# Altium schematic sheet WL-AUDIO.SchDoc
size 594 x 420 mm; Address1: Address1; Address2: Address2; Address3: Address3; Address4: Address4; DocumentNumber: Wolf-Lite; SheetNumber: 6; Scale: 1:1; DocumentType: Схема электрическая принципиальная; FirstReferrence: UA3REO/R7KBI
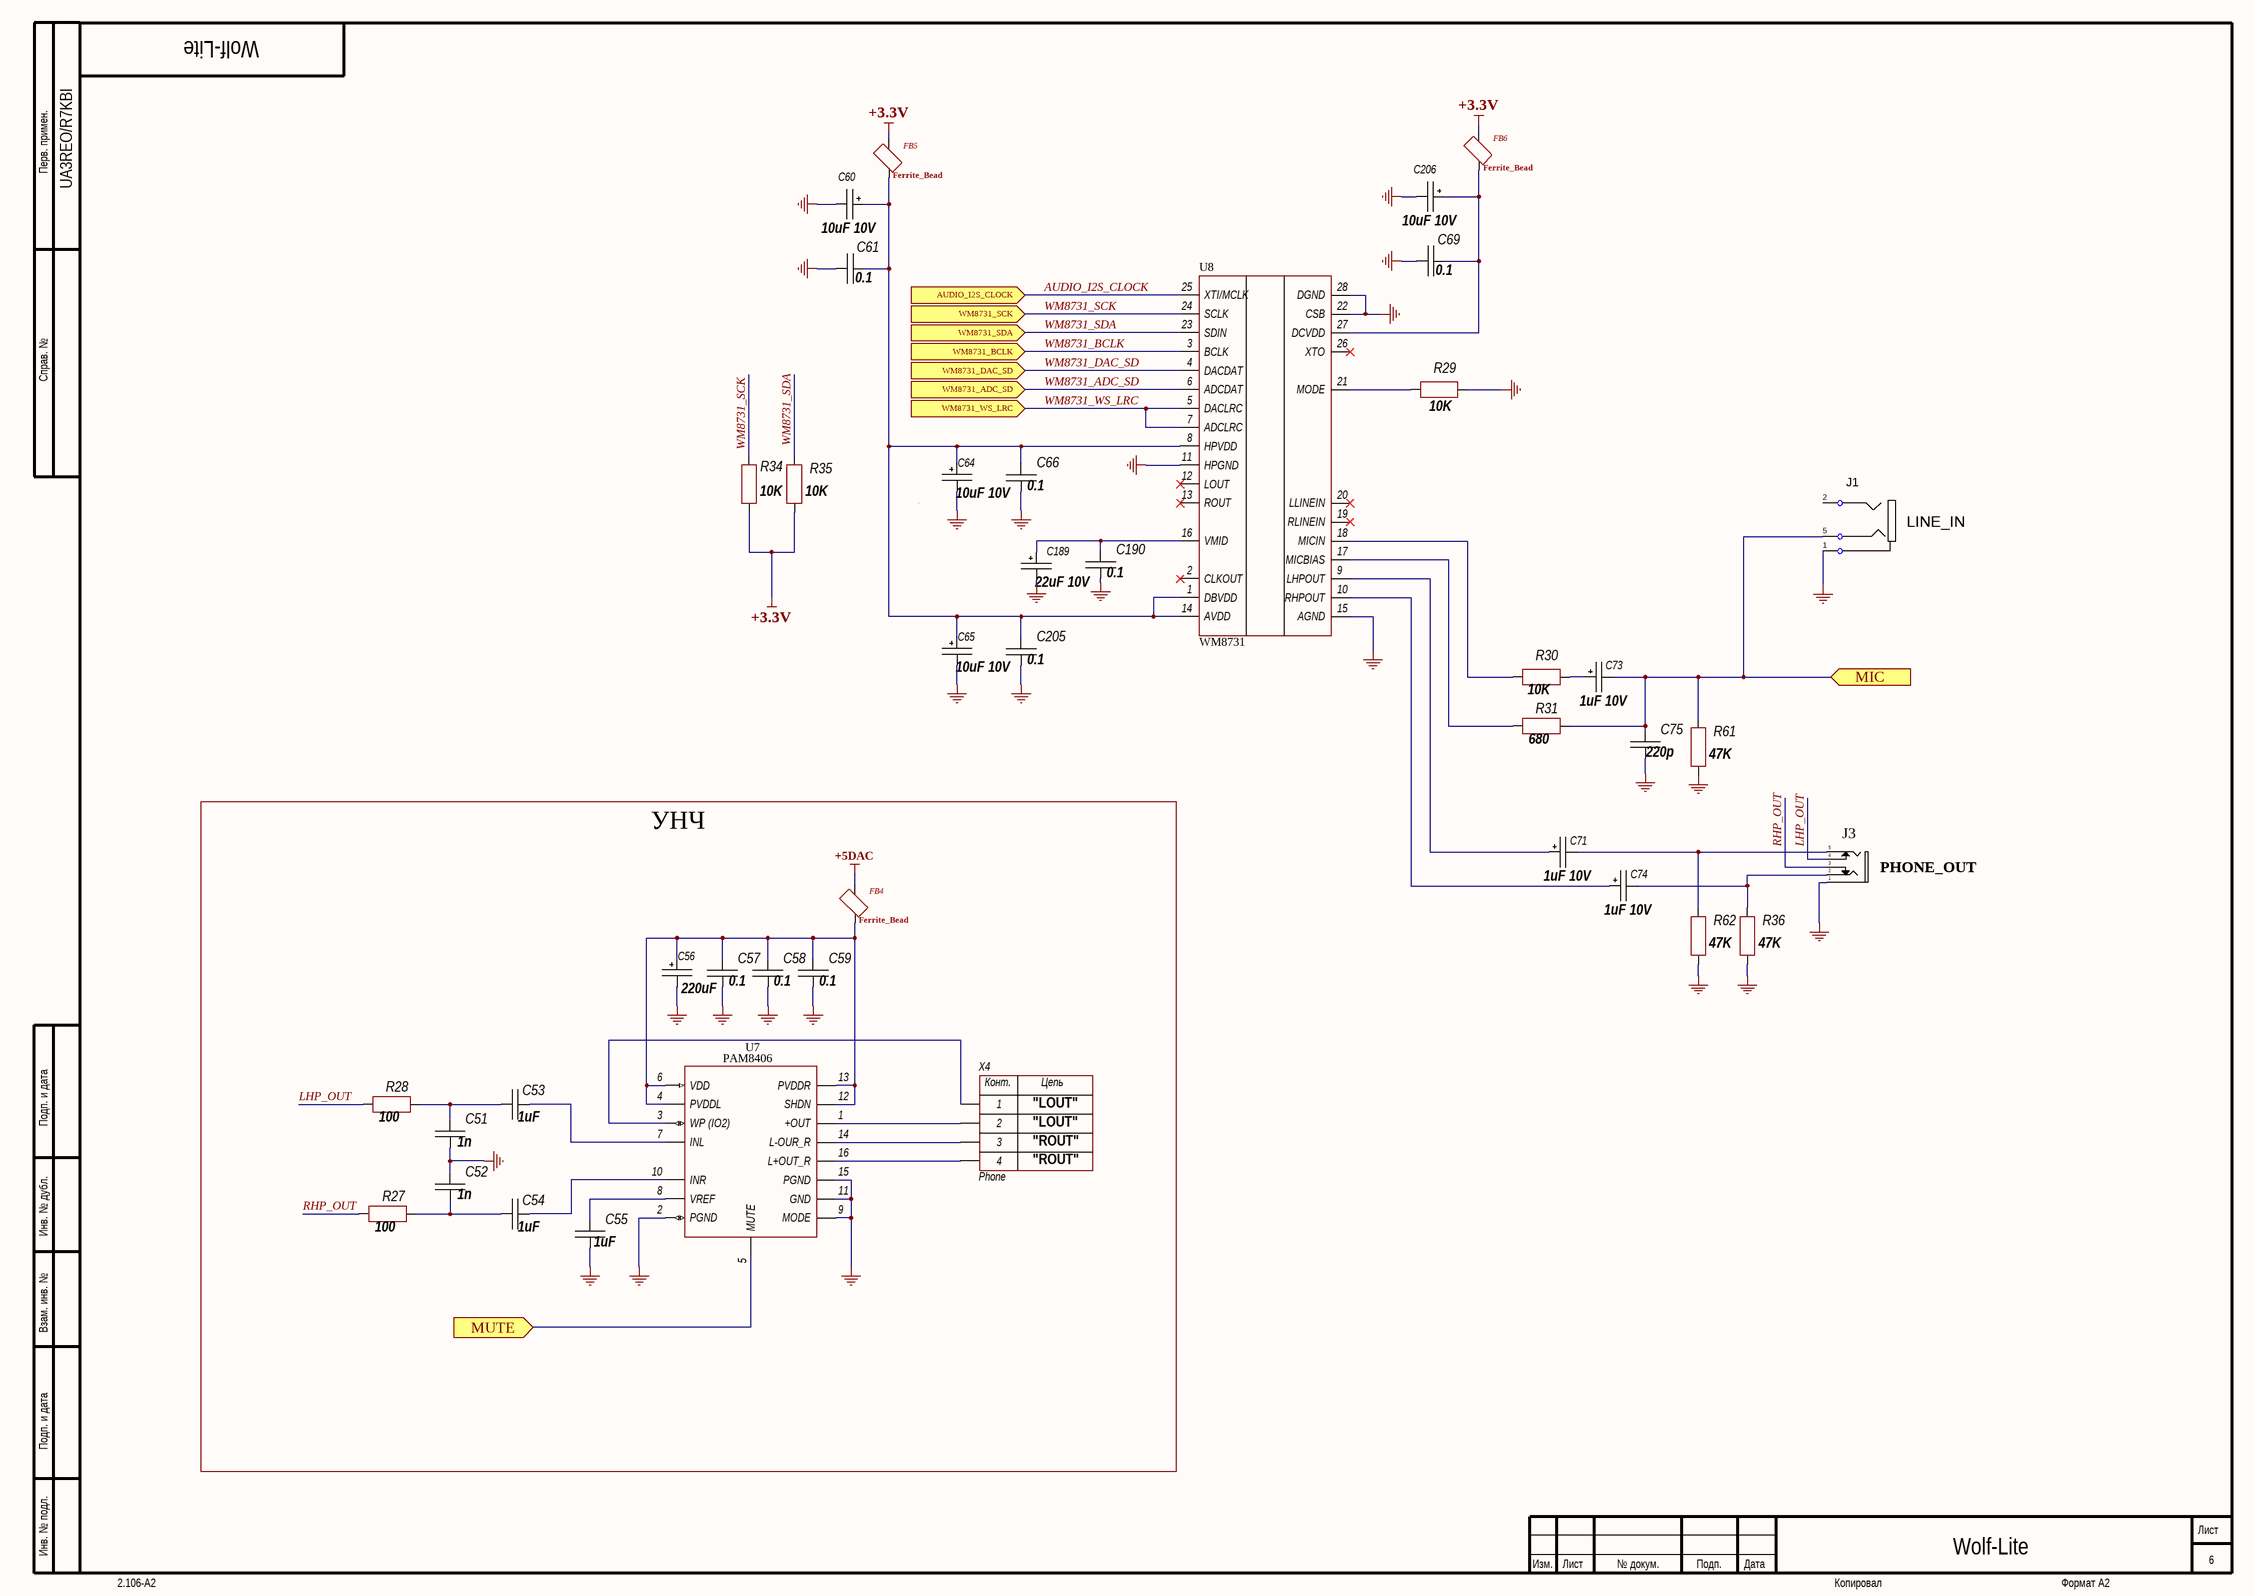
[diagram p0: WL-AUDIO.SchDoc]

## Parts
C51  1n  [CH0805C]
C52  1n  [CH0805C]
C53  1uF  [CH0805C]
C54  1uF  [CH0805C]
C55  1uF  [CH0805C]
C56  220uF  [POLIMER-E]
C57  0.1  [CH0805C]
C58  0.1  [CH0805C]
C59  0.1  [CH0805C]
C60  10uF 10V  [TANTAL_B]
C61  0.1  [CH0805C]
C64  10uF 10V  [TANTAL_B]
C65  10uF 10V  [TANTAL_B]
C66  0.1  [CH0805C]
C69  0.1  [CH0805C]
C71  1uF 10V  [TANTAL_A]
C73  1uF 10V  [TANTAL_A]
C74  1uF 10V  [TANTAL_A]
C75  220p  [CH0805C]
C189  22uF 10V  [TANTAL_B]
C190  0.1  [CH0805C]
C205  0.1  [CH0805C]
C206  10uF 10V  [TANTAL_B]
FB4  Ferrite_Bead  [CH0805L]
FB5  Ferrite_Bead  [CH0805L]
FB6  Ferrite_Bead  [CH0805L]
J1  value LINE_IN  [3.5-stereo]  (hidden comment: SJ1-3525NG)
J3  PHONE_OUT  [3.5-stereo]
R27  100  [CH0805R]
R28  100  [CH0805R]
R29  10K  [CH0805R]
R30  10K  [CH0805R]
R31  680  [CH0805R]
R34  10K  [CH0805R]
R35  10K  [CH0805R]
R36  47K  [CH0805R]
R61  47K  [CH0805R]
R62  47K  [CH0805R]
U7  PAM8406  [SOP-16]
U8  WM8731  [28-SSOP]
X4  Phone  [CON: CWF-4]

## Blocks framed on the sheet
УНЧ: C51-C59 FB4 R27 R28 U7 X4

## Ports
AUDIO_I2S_CLOCK (in), MIC (in), MUTE (in), WM8731_ADC_SD (in), WM8731_BCLK (in), WM8731_DAC_SD (in), WM8731_SCK (in), WM8731_SDA (in), WM8731_WS_LRC (in)

## Nets
+3.3V: FB5.2 FB6.2 R34.1 R35.1
+5DAC: FB4.2
GND: C51.2 C52.1 C55.2 C56.2 C57.2 C58.2 C59.2 C60.2 C61.2 C64.2 C65.2 C66.2 C69.2 C75.2 C189.2 C190.2 C205.2 C206.2 J1.1(sleeve) J3.1 R29.2 R36.1 R61.1 R62.1 U7.2(PGND) U7.9(MODE) U7.11(GND) U7.15(PGND) U8.11(HPGND) U8.15(AGND) U8.22(CSB) U8.28(DGND)
AUDIO_I2S_CLOCK: U8.25(XTI/MCLK) ; port AUDIO_I2S_CLOCK
LHP_OUT: J3.4 R28.1
MIC: C73.2 C75.1 J1.5(ring) R31.2 R61.2 ; port MIC
MUTE: U7.5(MUTE) ; port MUTE
RHP_OUT: J3.3 R27.1
WM8731_ADC_SD: U8.6(ADCDAT) ; port WM8731_ADC_SD
WM8731_BCLK: U8.3(BCLK) ; port WM8731_BCLK
WM8731_DAC_SD: U8.4(DACDAT) ; port WM8731_DAC_SD
WM8731_SCK: R34.2 U8.24(SCLK) ; port WM8731_SCK
WM8731_SDA: R35.2 U8.23(SDIN) ; port WM8731_SDA
WM8731_WS_LRC: U8.5(DACLRC) U8.7(ADCLRC) ; port WM8731_WS_LRC
NetC51_1: C51.1 C53.1 R28.2
NetC52_2: C52.2 C54.1 R27.2
NetC53_2: C53.2 U7.7(INL)
NetC54_2: C54.2 U7.10(INR)
NetC55_1: C55.1 U7.8(VREF)
NetC56_1: C56.1 C57.1 C58.1 C59.1 FB4.1 U7.4(PVDDL) U7.6(VDD) U7.12(SHDN) U7.13(PVDDR)
NetC60_1: C60.1 C61.1 C64.1 C65.1 C66.1 C205.1 FB5.1 U8.1(DBVDD) U8.8(HPVDD) U8.14(AVDD)
NetC69_1: C69.1 C206.1 FB6.1 U8.27(DCVDD)
NetC71_1: C71.1 U8.9(LHPOUT)
NetC71_2: C71.2 J3.5 R62.2
NetC73_1: C73.1 R30.2
NetC74_1: C74.1 U8.10(RHPOUT)
NetC74_2: C74.2 J3.2 R36.2
NetC189_1: C189.1 C190.1 U8.16(VMID)
NetR29_1: R29.1 U8.21(MODE)
NetR30_1: R30.1 U8.18(MICIN)
NetR31_1: R31.1 U8.17(MICBIAS)
NetU7_1: U7.1(+OUT) X4.2
NetU7_3: U7.3(WP_(IO2)) X4.1
NetU7_14: U7.14(L-OUR_R) X4.3
NetU7_16: U7.16(L+OUT_R) X4.4

Not connected (* = marked no-connect by the designer): J1 2(tip); U8 2(CLKOUT)* 12(LOUT)* 13(ROUT)* 19(RLINEIN)* 20(LLINEIN)* 26(XTO)*

## Notes on the sheet
- "LOUT"
- "ROUT"
- Перв. примен.
- Справ. №
- Подп. и дата
- Инв. № дубл.
- Взам. инв. №
- Инв. № подл.
- Изм.
- Лист
- № докум.
- Подп.
- Дата
- 2.106-A2
- Копировал
- Формат А2
- (in symbol 4-Connector) Конт.; Цепь

## Library data of the parts
C51-C55 C57-C59 C61 C66 C69 C75 C190 C205 = Capacitor: Manufacturer: *; Model: *; HelpURL: *; ComponentKind: *; Value: *
C56 C60 C64 C65 C71 C73 C74 C189 C206 = TantalCap: Manufacturer: *; Model: *; HelpURL: *; ComponentKind: *; Value: *
FB4-FB6 = FB
J1 = SJ1-3523N
J3 = PJ-3,5
R27-R31 R34-R36 R61 R62 = Resistor: Manufacturer: *; Model: *; HelpURL: *; ComponentKind: *; Value: *
X4 = 4-Connector: Model: *; Manufacturer: *; HelpURL: *; ComponentKind: *